# Altium schematic sheet 2020-05-20_19-43-391.schdoc
size 317 x 125 mm; SheetNumber: 1; SheetTotal: 1
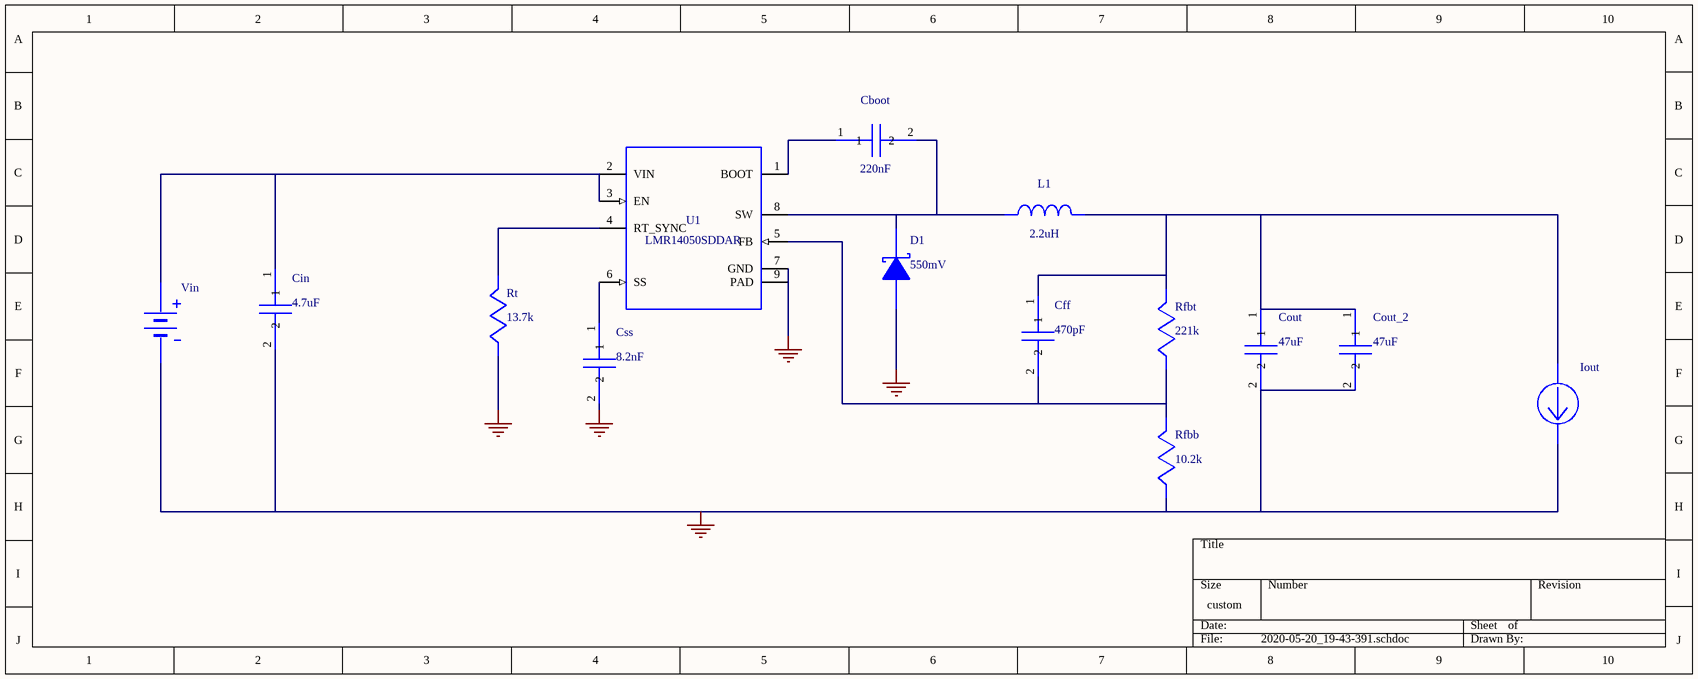
[diagram p0: 2020-05-20_19-43-391.schdoc]

## Parts
Cboot  value 220nF  (hidden comment: GRM21BR71H224MA01L)
Cff  value 470pF  (hidden comment: GRM155R71H471KA01D)
Cin  value 4.7uF  (hidden comment: GRM31CR71H475KA12L)
Cout  value 47uF  (hidden comment: 25SVPF47M)
Cout_2  value 47uF  (hidden comment: 25SVPF47M)
Css  value 8.2nF  (hidden comment: GRM155R71C822KA01D)
D1  value 550mV  (hidden comment: B540C-13-F)
Iout  WB_CURRENT_LOAD  (value not drawn)
L1  value 2.2uH  (hidden comment: VLP8040T-2R2N)
Rfbb  value 10.2k  (hidden comment: CRCW040210K2FKED)
Rfbt  value 221k  (hidden comment: CRCW0402221KFKED)
Rt  value 13.7k  (hidden comment: CRCW040213K7FKED)
U1  LMR14050SDDAR
Vin  WB_BATTERY  (value not drawn)

## Nets
0: Cin.2 Cout.2 Cout_2.2 Css.2 D1.2(A) Iout.2(-) Rfbb.2 Rt.2 U1.7(GND) U1.9(PAD) Vin.2(-)
NetCboot_1: Cboot.1 U1.1(BOOT)
NetCboot_2: Cboot.2 D1.1(K) L1.1 U1.8(SW)
NetCff_1: Cff.1 Cout.1 Cout_2.1 Iout.1(+) L1.2 Rfbt.1
NetCff_2: Cff.2 Rfbb.1 Rfbt.2 U1.5(FB)
NetCin_1: Cin.1 U1.2(VIN) U1.3(EN) Vin.1(+)
NetCss_1: Css.1 U1.6(SS)
NetRt_1: Rt.1 U1.4(RT_SYNC)

## Library data of the parts
Cboot = GRM21BR71H224MA01L: GRM21BR71H224MA0; Manufacturer Name: MuRata; PackageReference: GRM21BR71H224MA01L; Manufacturer Part Number: GRM21BR71H224MA01L
Cff = GRM155R71H471KA01D: GRM155R71H471KA0; Manufacturer Name: MuRata; PackageReference: GRM155R71H471KA01D; Manufacturer Part Number: GRM155R71H471KA01D
Cin = GRM31CR71H475KA12L: GRM31CR71H475KA1; Manufacturer Name: MuRata; PackageReference: GRM31CR71H475KA12L; Manufacturer Part Number: GRM31CR71H475KA12L
Cout Cout_2 = 25SVPF47M: Manufacturer Name: Panasonic; PackageReference: 25SVPF47M; Manufacturer Part Number: 25SVPF47M
Css = GRM155R71C822KA01D: GRM155R71C822KA0; Manufacturer Name: MuRata; PackageReference: GRM155R71C822KA01D; Manufacturer Part Number: GRM155R71C822KA01D
D1 = B540C-13-F: Manufacturer Name: Diodes Inc.; PackageReference: B540C-13-F; Manufacturer Part Number: B540C-13-F
L1 = VLP8040T-2R2N: Unknown; Manufacturer Name: TDK; PackageReference: VLP8040T-2R2N; Manufacturer Part Number: VLP8040T-2R2N
Rfbb = CRCW040210K2FKED: Manufacturer Name: Vishay-Dale; PackageReference: CRCW040210K2FKED; Manufacturer Part Number: CRCW040210K2FKED
Rfbt = CRCW0402221KFKED: Manufacturer Name: Vishay-Dale; PackageReference: CRCW0402221KFKED; Manufacturer Part Number: CRCW0402221KFKED
Rt = CRCW040213K7FKED: Manufacturer Name: Vishay-Dale; PackageReference: CRCW040213K7FKED; Manufacturer Part Number: CRCW040213K7FKED
U1 = LMR14050SDDAR: Manufacturer Name: Texas Instruments; PackageReference: LMR14050SDDAR; Manufacturer Part Number: LMR14050SDDAR; Value: N/A
Iout = WB_CURRENT_LOAD: PackageReference: WB_CURRENT_LOAD; Manufacturer Part Number: WB_CURRENT_LOAD; Manufacturer Name: WB_CURRENT_LOAD; Value: N/A
Vin = WB_BATTERY: PackageReference: WB_BATTERY; Manufacturer Part Number: WB_BATTERY; Manufacturer Name: WB_BATTERY; Value: N/A